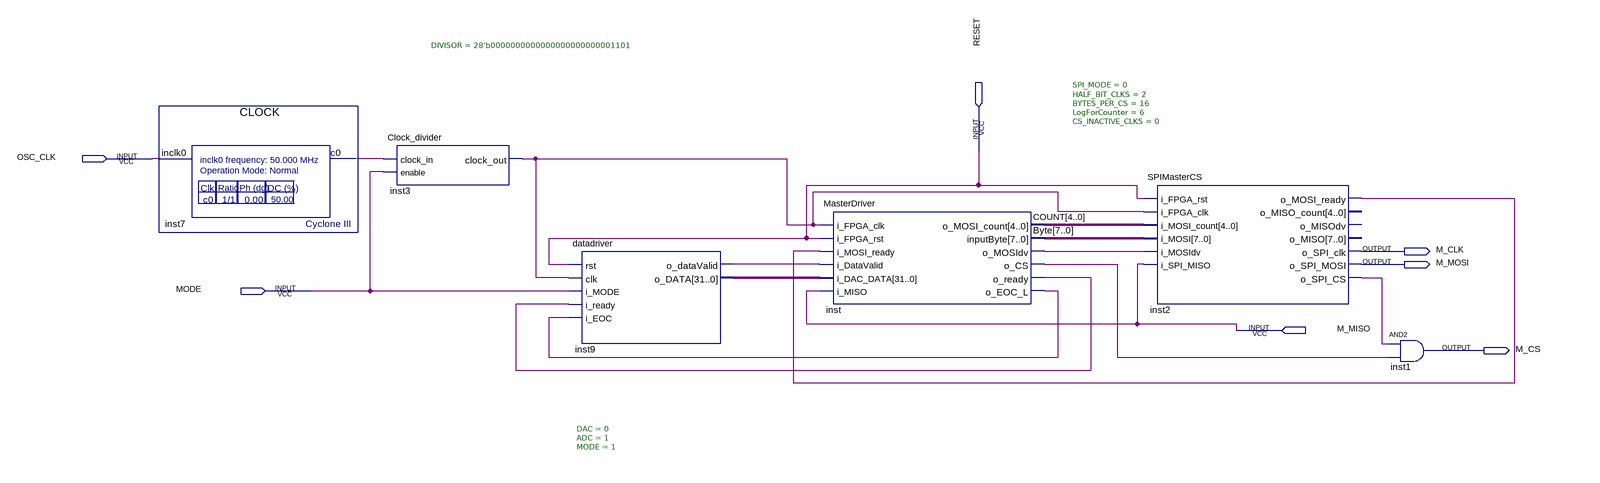
[diagram p0: schematic sheet]
// Quartus schematic BlockWDriver.bdf as structural Verilog: 6 symbols, 7 pins
module BlockWDriver (
  input  RESET,
  input  OSC_CLK,
  input  MODE,
  input  M_MISO,
  output M_CLK,
  output M_MOSI,
  output M_CS
);

  wire inst2_o_mosi_ready, inst2_o_spi_cs, inst3_clock_out, inst7_c0, inst9_o_datavalid, inst_o_cs,
       inst_o_eoc_l, inst_o_mosidv, inst_o_ready;
  wire [4:0] COUNT;
  wire [7:0] Byte;
  wire [31:0] inst9_o_data;

  CLOCK inst7 (.inclk0(OSC_CLK), .c0(inst7_c0));
  Clock_divider #(.DIVISOR(28'b0000000000000000000000001101)) inst3 (
    .clock_in(inst7_c0), .enable(MODE), .clock_out(inst3_clock_out));
  datadriver #(.DAC(0), .ADC(1), .MODE(1)) inst9 (
    .rst(RESET), .clk(inst3_clock_out), .i_MODE(MODE), .i_ready(inst_o_ready), .i_EOC(inst_o_eoc_l),
    .o_dataValid(inst9_o_datavalid), .o_DATA(inst9_o_data));
  MasterDriver inst (
    .i_FPGA_clk(inst3_clock_out), .i_FPGA_rst(RESET), .i_MOSI_ready(inst2_o_mosi_ready),
    .i_DataValid(inst9_o_datavalid), .i_DAC_DATA(inst9_o_data), .i_MISO(M_MISO), .o_MOSI_count(COUNT),
    .inputByte(Byte), .o_MOSIdv(inst_o_mosidv), .o_CS(inst_o_cs), .o_ready(inst_o_ready),
    .o_EOC_L(inst_o_eoc_l));
  SPIMasterCS #(.SPI_MODE(0), .HALF_BIT_CLKS(2), .BYTES_PER_CS(16), .LogForCounter(6), .CS_INACTIVE_CLKS(0)) inst2 (
    .i_FPGA_rst(RESET), .i_FPGA_clk(inst3_clock_out), .i_MOSI_count(COUNT), .i_MOSI(Byte),
    .i_MOSIdv(inst_o_mosidv), .i_SPI_MISO(M_MISO), .o_MOSI_ready(inst2_o_mosi_ready), .o_SPI_clk(M_CLK),
    .o_SPI_MOSI(M_MOSI), .o_SPI_CS(inst2_o_spi_cs));  // open: o_MISO_count, o_MISOdv, o_MISO
  and inst1 (M_CS, inst2_o_spi_cs, inst_o_cs);
endmodule
